# EAGLE design vhdci-fx2-gnd (EAGLE 6.4)
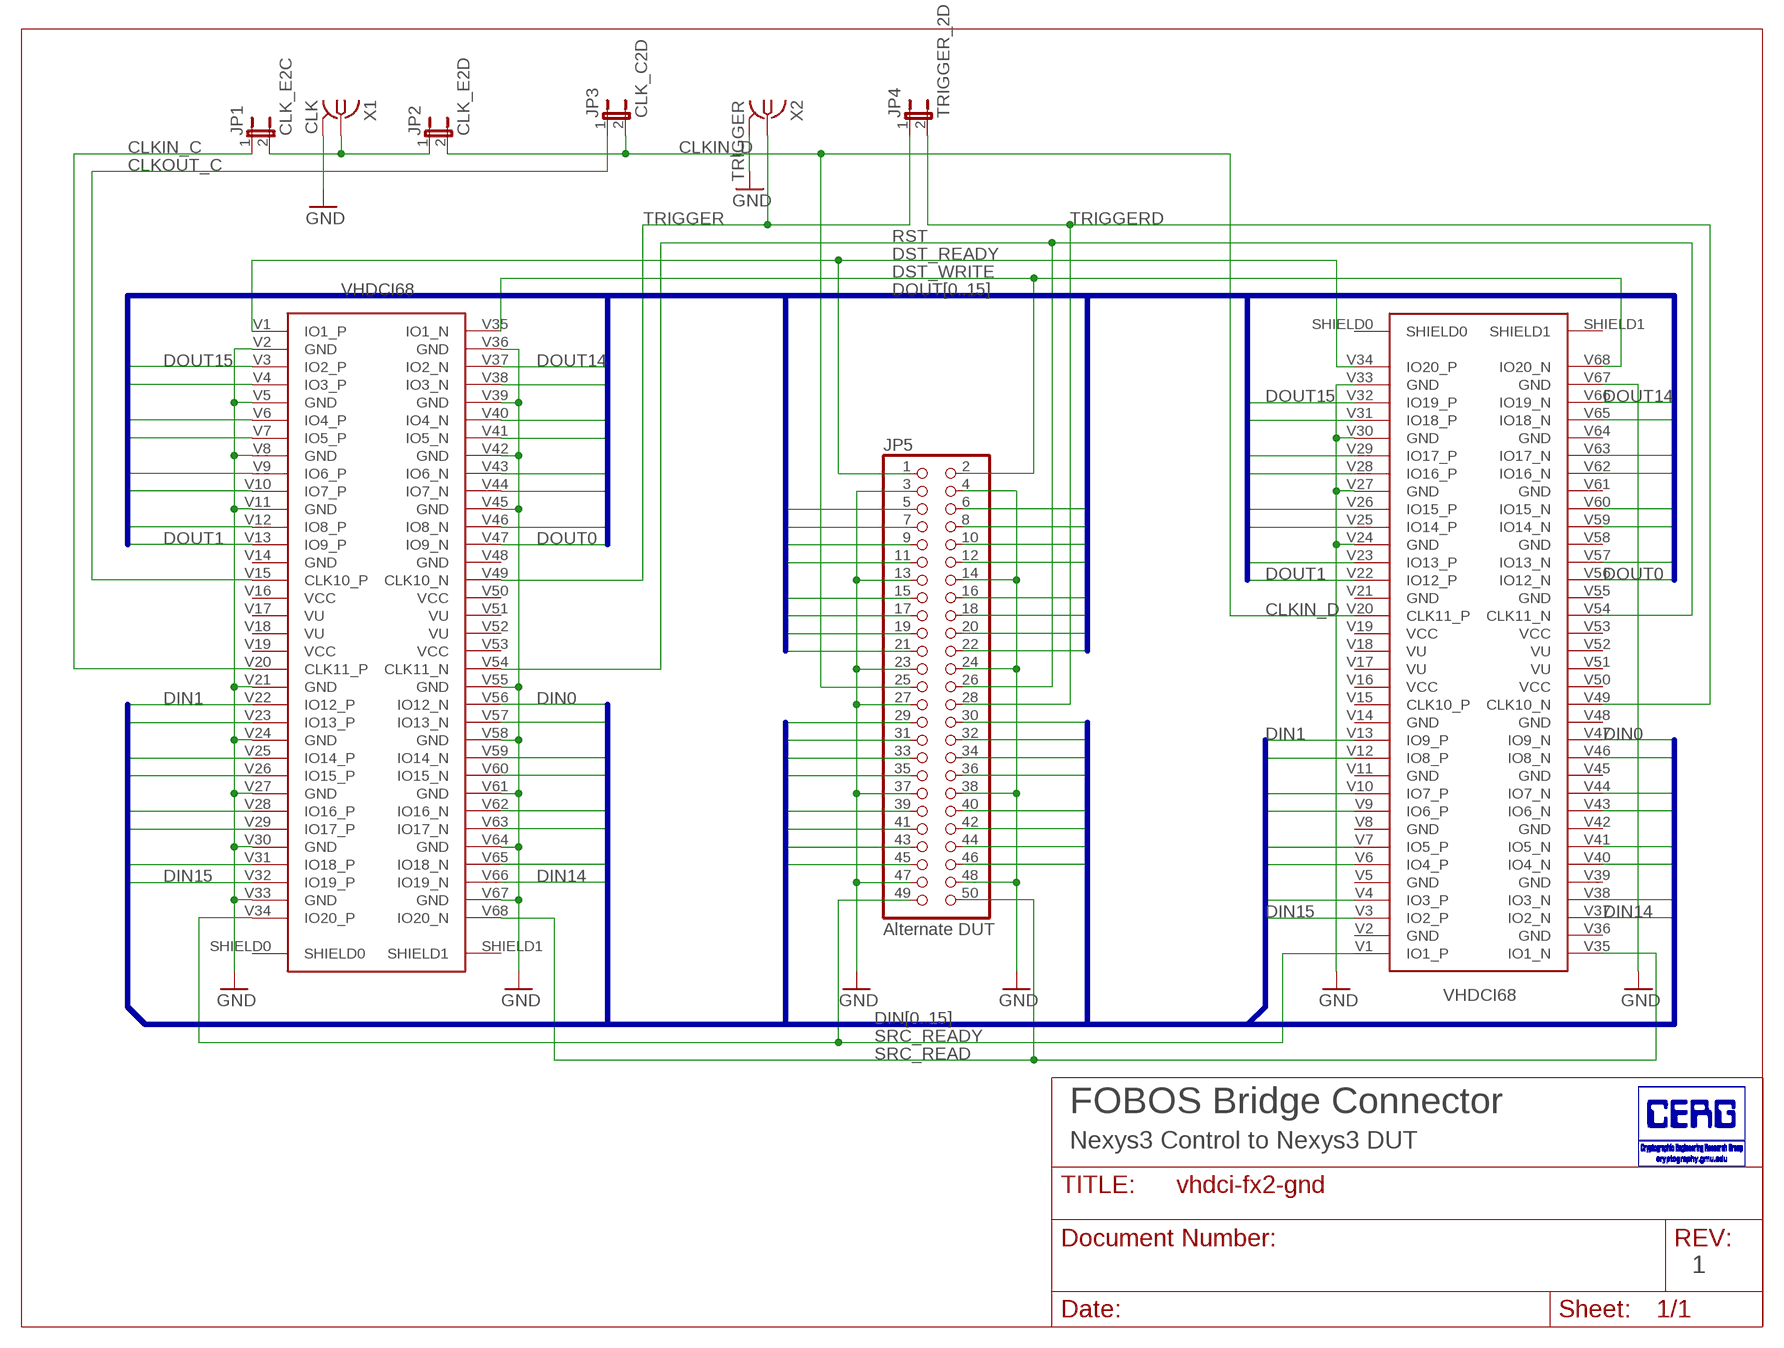
[diagram p0: schematic, sheet 1]

## Parts
JP1  CLK_E2C  JP1E  [JP1]
JP2  CLK_E2D  JP1E  [JP1]
JP3  CLK_C2D  JP1E  [JP1]
JP4  TRIGGER_2D  JP1E  [JP1]
JP5  Alternate DUT  PINHD-2X25  [2X25]
U$1  VHDCI68  [VHDCI68]
U$2  VHDCI68  [VHDCI68]
X1  CLK  BU-SMA-V  [BU-SMA-V]
X2  TRIGGER  BU-SMA-V  [BU-SMA-V]

## Nets
CLKIN_C: JP1.1 U$2.V20(CLK11_P)
CLKIN_D: JP2.2 JP3.2 JP5.25 U$1.V20(CLK11_P)
CLKOUT_C: JP3.1 U$2.V15(CLK10_P)
DIN0: JP5.30 U$1.V47(IO9_N) U$2.V56(IO12_N)
DIN1: JP5.29 U$1.V13(IO9_P) U$2.V22(IO12_P)
DIN2: JP5.32 U$1.V46(IO8_N) U$2.V57(IO13_N)
DIN3: JP5.31 U$1.V12(IO8_P) U$2.V23(IO13_P)
DIN4: JP5.34 U$1.V44(IO7_N) U$2.V59(IO14_N)
DIN5: JP5.33 U$1.V10(IO7_P) U$2.V25(IO14_P)
DIN6: JP5.36 U$1.V43(IO6_N) U$2.V60(IO15_N)
DIN7: JP5.35 U$1.V9(IO6_P) U$2.V26(IO15_P)
DIN8: JP5.40 U$1.V41(IO5_N) U$2.V62(IO16_N)
DIN9: JP5.39 U$1.V7(IO5_P) U$2.V28(IO16_P)
DIN10: JP5.42 U$1.V40(IO4_N) U$2.V63(IO17_N)
DIN11: JP5.41 U$1.V6(IO4_P) U$2.V29(IO17_P)
DIN12: JP5.44 U$1.V38(IO3_N) U$2.V65(IO18_N)
DIN13: JP5.43 U$1.V4(IO3_P) U$2.V31(IO18_P)
DIN14: JP5.46 U$1.V37(IO2_N) U$2.V66(IO19_N)
DIN15: JP5.45 U$1.V3(IO2_P) U$2.V32(IO19_P)
DOUT0: JP5.22 U$1.V56(IO12_N) U$2.V47(IO9_N)
DOUT1: JP5.21 U$1.V22(IO12_P) U$2.V13(IO9_P)
DOUT2: JP5.20 U$1.V57(IO13_N) U$2.V46(IO8_N)
DOUT3: JP5.19 U$1.V23(IO13_P) U$2.V12(IO8_P)
DOUT4: JP5.18 U$1.V59(IO14_N) U$2.V44(IO7_N)
DOUT5: JP5.17 U$1.V25(IO14_P) U$2.V10(IO7_P)
DOUT6: JP5.16 U$1.V60(IO15_N) U$2.V43(IO6_N)
DOUT7: JP5.15 U$1.V26(IO15_P) U$2.V9(IO6_P)
DOUT8: JP5.12 U$1.V62(IO16_N) U$2.V41(IO5_N)
DOUT9: JP5.11 U$1.V28(IO16_P) U$2.V7(IO5_P)
DOUT10: JP5.10 U$1.V63(IO17_N) U$2.V40(IO4_N)
DOUT11: JP5.9 U$1.V29(IO17_P) U$2.V6(IO4_P)
DOUT12: JP5.8 U$1.V65(IO18_N) U$2.V38(IO3_N)
DOUT13: JP5.7 U$1.V31(IO18_P) U$2.V4(IO3_P)
DOUT14: JP5.6 U$1.V66(IO19_N) U$2.V37(IO2_N)
DOUT15: JP5.5 U$1.V32(IO19_P) U$2.V3(IO2_P)
DST_READY: JP5.1 U$1.V34(IO20_P) U$2.V1(IO1_P)
DST_WRITE: JP5.2 U$1.V68(IO20_N) U$2.V35(IO1_N)
GND: JP5.3 JP5.4 JP5.13 JP5.14 JP5.23 JP5.24 JP5.27 JP5.37 JP5.38 JP5.47 JP5.48 U$1.V24(GND) U$1.V27(GND) U$1.V30(GND) U$1.V33(GND) U$1.V67(GND) U$2.V2(GND) U$2.V5(GND) U$2.V8(GND) U$2.V11(GND) U$2.V21(GND) U$2.V24(GND) U$2.V27(GND) U$2.V30(GND) U$2.V33(GND) U$2.V36(GND) U$2.V39(GND) U$2.V42(GND) U$2.V45(GND) U$2.V55(GND) U$2.V58(GND) U$2.V61(GND) U$2.V64(GND) U$2.V67(GND) X1.2(GND) X2.2(GND)
N$3: JP1.2 JP2.1 X1.1
RST: JP5.26 U$1.V54(CLK11_N) U$2.V54(CLK11_N)
SRC_READ: JP5.50 U$1.V35(IO1_N) U$2.V68(IO20_N)
SRC_READY: JP5.49 U$1.V1(IO1_P) U$2.V34(IO20_P)
TRIGGER: JP4.1 U$2.V49(CLK10_N) X2.1
TRIGGERD: JP4.2 JP5.28 U$1.V49(CLK10_N)
Unconnected: U$1.SHIELD0 U$1.SHIELD1 U$1.V2(GND) U$1.V5(GND) U$1.V8(GND) U$1.V11(GND) U$1.V14(GND) U$1.V15(CLK10_P) U$1.V21(GND) U$1.V36(GND) U$1.V39(GND) U$1.V42(GND) U$1.V45(GND) U$1.V48(GND) U$1.V55(GND) U$1.V58(GND) U$1.V61(GND) U$1.V64(GND) U$2.SHIELD0 U$2.SHIELD1 U$2.V14(GND) U$2.V48(GND)

## Buses
DIN[0..15]
DOUT[0..15]

## Notes on the sheet
- FOBOS Bridge Connector
- Nexys3 Control to Nexys3 DUT
- 1

## Power pins joined to a net without a drawn wire
GND: X1.3(GND) X1.4(GND) X1.5(GND) X2.3(GND) X2.4(GND) X2.5(GND)
VCC: U$1.V16(VCC) U$1.V19(VCC) U$1.V50(VCC) U$1.V53(VCC) U$2.V16(VCC) U$2.V19(VCC) U$2.V50(VCC) U$2.V53(VCC)
VU: U$1.V17(VU) U$1.V18(VU) U$1.V51(VU) U$1.V52(VU) U$2.V17(VU) U$2.V18(VU) U$2.V51(VU) U$2.V52(VU)

## Library data of the parts
JP1-JP4 = jumper:JP1E: JUMPER
JP5 = pinhead:PINHD-2X25: PIN HEADER
U$1 U$2 = tw:VHDCI68: Nexys 3 VHDCI 68pin 0.8mm pitch
X1 X2 = con-coax:BU-SMA-V: FEMALE SMA CONNECTOR Radiall distributor RS 112-3794; OC_FARNELL: unknown; OC_NEWARK: unknown

## Board
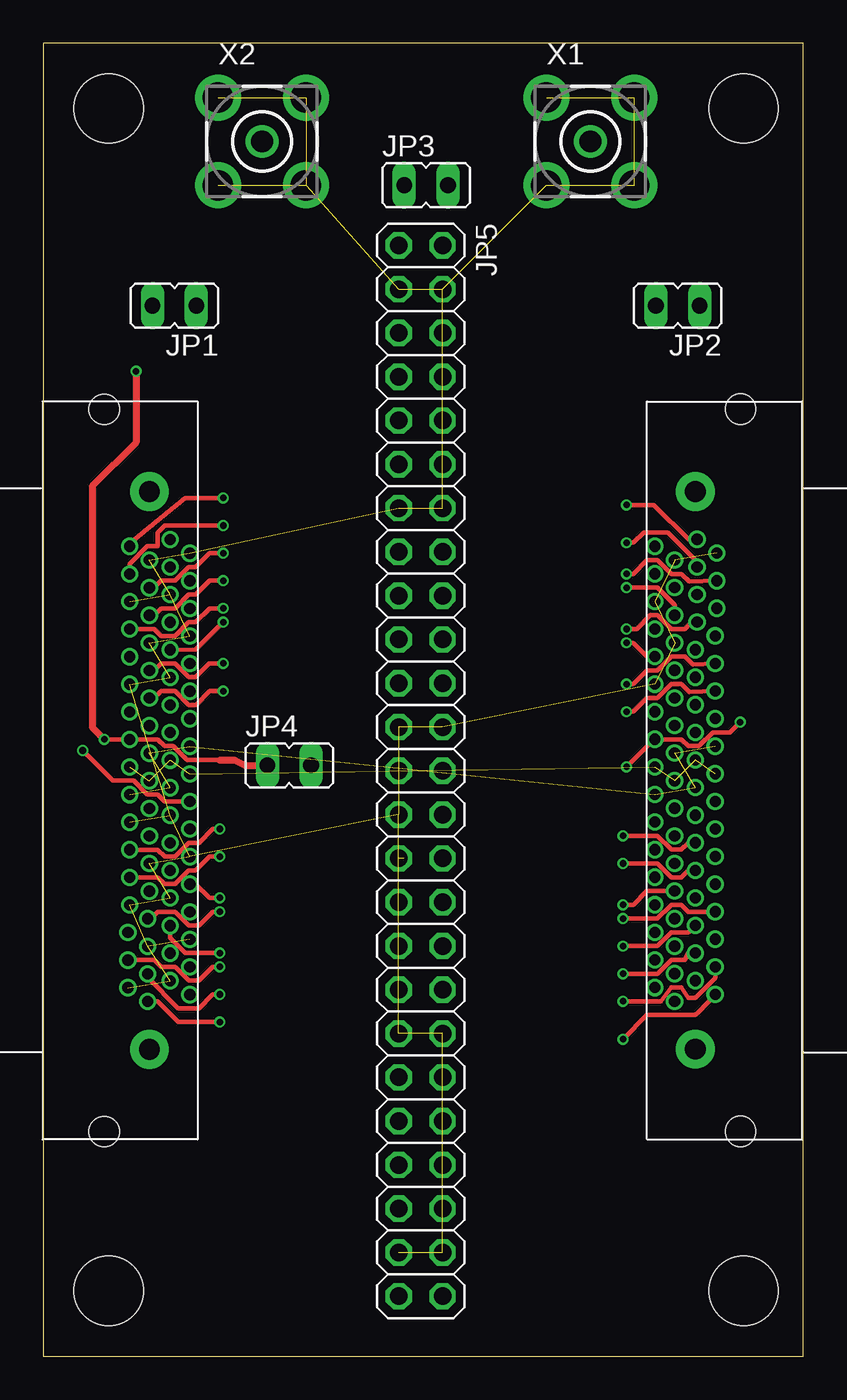
[diagram p1: board, top side]
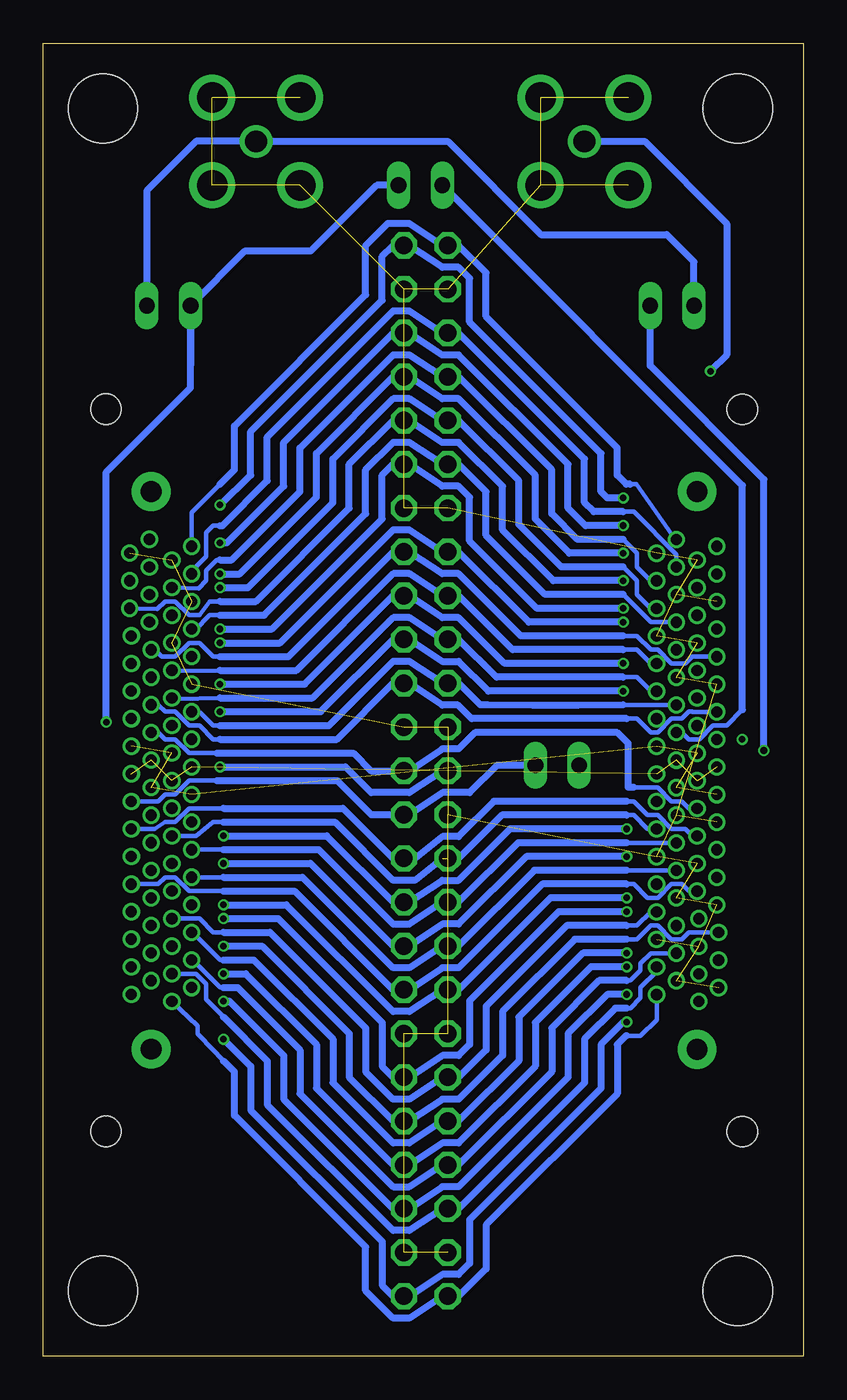
[diagram p2: board, bottom side, seen from below]

Size 44.12 x 76.19 mm. Coordinates in mm from the lower left corner, seen from the top.
Outline: 0,0 44.12,0 44.12,76.19 0,76.19 0,0
Copper layers (1*16): Top 0.035mm / dielectric 1.5mm / Bottom 0.035mm
Design rules "vhdci-fx2": minimum track width 5mil, minimum drill 15mil, track to track 5mil, track to pad 5mil, pad to pad 5mil, via to via 5mil, smd to smd 5mil, copper to edge 40mil, drill to drill 8mil, minimum pad ring 5mil, minimum via ring 5mil, stop-mask expansion 4mil, vias tented up to drill 0mil, thermal gap 10mil
Holes 4 mm at 3.81,72.39 3.81,3.81 40.64,3.81 40.64,72.39

### Footprints (pad centres in the part's own frame; a part is rotated, then mirrored left to right if it is on the bottom)
JP1 = drill 0.914 long: 1 0,-1.27; 2 0,1.27
2X25 = drill 1.016 octagon: 1 -30.48,-1.27; 2 -30.48,1.27; 3 -27.94,-1.27; 4 -27.94,1.27; 5 -25.4,-1.27; 6 -25.4,1.27; 7 -22.86,-1.27; 8 -22.86,1.27; 9 -20.32,-1.27; 10 -20.32,1.27; 11 -17.78,-1.27; 12 -17.78,1.27; 13 -15.24,-1.27; 14 -15.24,1.27; 15 -12.7,-1.27; 16 -12.7,1.27; 17 -10.16,-1.27; 18 -10.16,1.27; 19 -7.62,-1.27; 20 -7.62,1.27; 21 -5.08,-1.27; 22 -5.08,1.27; 23 -2.54,-1.27; 24 -2.54,1.27; 25 0,-1.27; 26 0,1.27; 27 2.54,-1.27; 28 2.54,1.27; 29 5.08,-1.27; 30 5.08,1.27; 31 7.62,-1.27; 32 7.62,1.27; 33 10.16,-1.27; 34 10.16,1.27; 35 12.7,-1.27; 36 12.7,1.27; 37 15.24,-1.27; 38 15.24,1.27; 39 17.78,-1.27; 40 17.78,1.27; 41 20.32,-1.27; 42 20.32,1.27; 43 22.86,-1.27; 44 22.86,1.27; 45 25.4,-1.27; 46 25.4,1.27; 47 27.94,-1.27; 48 27.94,1.27; 49 30.48,-1.27; 50 30.48,1.27
VHDCI68 = drill 1.2 pad 2.25: SHIELD0 18.375,-0.4; SHIELD1 -13.975,-0.4 | drill 0.65 pad 1: V1 -11.2,0.8; V2 -10.4,1.95; V3 -9.6,0.8; V4 -8.8,1.95; V5 -8,0.8; V6 -7.2,1.95; V7 -6.4,0.8; V8 -5.6,1.95; V9 -4.8,0.8; V10 -4,1.95; V11 -3.2,0.8; V12 -2.4,1.95; V13 -1.6,0.8; V14 -0.8,1.95; V15 0,0.8; V16 0.8,1.95; V17 1.6,0.8; V18 2.4,1.95; V19 3.2,0.8; V20 4,1.95; V21 4.8,0.8; V22 5.6,1.95; V23 6.4,0.8; V24 7.2,1.95; V25 8,0.8; V26 8.8,1.95; V27 9.6,0.8; V28 10.4,1.95; V29 11.2,0.8; V30 12,1.95; V31 12.8,0.8; V32 13.6,1.95; V33 14.4,0.8; V34 15.2,1.95; V35 -10.8,-1.55; V36 -10,-0.4; V37 -9.2,-1.55; V38 -8.4,-0.4; V39 -7.6,-1.55; V40 -6.8,-0.4; V41 -6,-1.55; V42 -5.2,-0.4; V43 -4.4,-1.55; V44 -3.6,-0.4; V45 -2.8,-1.55; V46 -2,-0.4; V47 -1.2,-1.55; V48 -0.4,-0.4; V49 0.4,-1.55; V50 1.2,-0.4; V51 2,-1.55; V52 2.8,-0.4; V53 3.6,-1.55; V54 4.4,-0.4; V55 5.2,-1.55; V56 6,-0.4; V57 6.8,-1.55; V58 7.6,-0.4; V59 8.4,-1.55; V60 9.2,-0.4; V61 10,-1.55; V62 10.8,-0.5; V63 11.6,-1.65; V64 12.4,-0.5; V65 13.2,-1.65; V66 14,-0.5; V67 14.8,-1.65; V68 15.6,-0.5 | hole 1.75: -18.75,-3.025; 23.15,-3.025
BU-SMA-V = drill 1.27: 1 0,0 | drill 1.778: 2 -2.55,2.55; 3 2.55,2.55; 4 2.55,-2.55; 5 -2.55,-2.55

### Placement (x,y rotation side)
JP1  7.62,60.96 90 top
JP2  36.83,60.96 90 top
JP3  22.23,67.94 270 top
JP4  14.29,34.29 270 top
JP5  21.91,33.97 270 top
U$1  37.45,31.8 90 top
U$2  6.57,36.19 270 top
X1  31.75,70.48 0 top
X2  12.7,70.48 0 top

### Tracks (layer width: path | path; a pad name or v marks a point on that pad's centre or on a via)
CLKIN_C  (via drill 0.38)
  Top 0.254: U$2.V20 7.06,32.19 6.65,32.6 6.05,32.6 5.25,33.4 4.05,33.4 v2.3,35.15
  Bottom 0.406: v2.3,35.15 2.3,50.88 8.89,57.47 JP1.1
CLKIN_D  (via drill 0.38)
  Top 0.254: v40.45,36.8 39.85,36.2 38.85,36.2 38.05,35.4 37.45,35.4 37.05,35.8 U$1.V20 35.45,35.8 v33.85,34.2
  Bottom 0.406: JP3.2 24.77,67.94 28.57,64.14 32.38,64.14 JP2.2 | JP2.2 35.56,57.47 | JP5.25 20.95,33.97 22.86,32.7 25.08,32.7 26.58,34.2 v33.85,34.2 | v40.45,36.8 40.45,51.31 35.56,56.2 JP2.2
CLKOUT_C
  Bottom 0.254: U$2.V15 7.04,36.19 6.65,35.8 6.05,35.8 5.25,36.6 4.45,36.6 3.53,37.52
  Bottom 0.406: 3.53,37.52 3.53,50.52 JP3.1
DIN0
  Bottom 0.254: U$2.V56 6.44,30.19 6.85,30.6 7.65,30.6 8.45,31.4 9.05,31.4 9.85,32.2 10.25,32.2 | U$1.V47 37.65,30.6 37.05,31 36.45,31 35.65,31.8 33.65,31.8
  Bottom 0.406: 10.25,32.2 17.97,32.2 20,30.16 20.95,30.16 22.54,28.89 JP5.30 23.81,28.89 26.72,31.8 33.65,31.8
DIN1  (1 unrouted)
  Bottom 0.254: U$2.V22 9.04,30.59 9.85,31.4 10.25,31.4 | U$1.V13 35.25,30.2 34.25,31 33.65,31
  Bottom 0.406: 10.25,31.4 17.49,31.4 20,28.89 20.95,28.89 22.54,27.62 23.81,27.62 27.19,31 33.65,31
DIN2  (via drill 0.38)
  Top 0.254: U$2.V57 6.66,29.39 7.05,29 7.65,29 8.45,29.8 9.05,29.8 9.85,30.6 v10.25,30.6 | U$1.V46 37.45,29.8 37.05,29.4 36.45,29.4 35.65,30.2 v33.65,30.2
  Bottom 0.406: v33.65,30.2 27.66,30.2 23.81,26.35 JP5.32 22.86,26.35 20.95,27.62 20,27.62 17.02,30.6 v10.25,30.6
DIN3
  Bottom 0.254: U$2.V23 10.24,29.79 10.25,29.8 | U$1.V12 33.65,29.4
  Bottom 0.406: 33.65,29.4 28.13,29.4 23.81,25.08 22.86,25.08 20.95,26.35 JP5.31 20,26.35 16.55,29.8 10.25,29.8
DIN4  (via drill 0.38)
  Top 0.254: U$2.V59 6.66,27.79 7.05,27.4 7.65,27.4 8.45,28.2 8.85,28.2 9.65,29 v10.25,29 | U$1.V44 37.45,28.2 37.05,27.8 36.45,27.8 35.65,28.6 v33.65,28.6
  Bottom 0.406: v10.25,29 16.09,29 20,25.08 20.95,25.08 22.86,23.81 JP5.34 23.81,23.81 28.6,28.6 v33.65,28.6
DIN5
  Bottom 0.254: U$2.V25 10.24,28.19 10.25,28.2 | U$1.V10 33.65,27.8
  Bottom 0.406: 10.25,28.2 15.62,28.2 20,23.81 JP5.33 20.95,23.81 22.86,22.54 23.81,22.54 29.07,27.8 33.65,27.8
DIN6
  Bottom 0.254: U$2.V60 6.64,26.99 7.05,27.4 7.65,27.4 8.45,26.6 9.05,26.6 9.85,27.4 10.25,27.4 | U$1.V43 37.45,27.4 37.05,27.8 36.45,27.8 35.65,27 33.65,27
  Bottom 0.406: 10.25,27.4 15.15,27.4 20,22.54 20.95,22.54 22.86,21.27 JP5.36 23.81,21.27 29.54,27 33.65,27
DIN7  (via drill 0.38)
  Top 0.254: U$2.V26 8.86,27.39 9.65,26.6 v10.25,26.6 | U$1.V9 35.05,27 34.25,26.2 v33.65,26.2
  Bottom 0.406: v10.25,26.6 14.67,26.6 20,21.27 JP5.35 20.95,21.27 22.86,20 23.81,20 30.01,26.2 v33.65,26.2
DIN8  (via drill 0.38)
  Top 0.254: U$2.V62 6.24,25.39 6.65,25.8 7.65,25.8 8.45,25 9.05,25 9.85,25.8 v10.25,25.8 | U$1.V41 37.45,25.8 37.05,26.2 36.45,26.2 35.65,25.4 v33.65,25.4
  Bottom 0.406: v10.25,25.8 14.21,25.8 19.37,20.64 19.37,18.1 20,17.46 20.95,17.46 22.86,16.19 JP5.40 23.81,16.19 24.45,16.83 24.45,19.37 30.48,25.4 v33.65,25.4
DIN9
  Bottom 0.254: U$2.V28 8.86,25.79 9.65,25 10.25,25 | U$1.V7 35.05,25.4 34.25,24.6 33.65,24.6
  Bottom 0.406: 10.25,25 13.74,25 18.41,20.32 18.41,17.78 20,16.19 JP5.39 20.95,16.19 22.86,14.92 23.81,14.92 25.4,16.51 25.4,19.05 30.95,24.6 33.65,24.6
DIN10  (via drill 0.38)
  Top 0.254: U$1.V40 37.45,24.6 36.45,24.6 35.65,23.8 v33.65,23.8
  Bottom 0.254: U$2.V63 6.64,24.59 6.65,24.6 7.05,24.2 7.65,24.2 8.45,25 8.85,25 9.65,24.2 10.25,24.2
  Bottom 0.406: 10.25,24.2 13.26,24.2 17.46,20 17.46,17.46 20,14.92 20.95,14.92 22.86,13.65 JP5.42 23.81,13.65 26.35,16.19 26.35,18.73 31.42,23.8 v33.65,23.8
DIN11  (via drill 0.38)
  Top 0.254: U$2.V29 7.37,24.28 8.25,23.4 v10.25,23.4
  Bottom 0.254: U$1.V6 35.45,24.6 33.85,23 33.65,23
  Bottom 0.406: v10.25,23.4 12.79,23.4 16.51,19.68 16.51,17.14 20,13.65 JP5.41 20.95,13.65 22.86,12.38 23.81,12.38 27.3,15.88 27.3,18.41 31.89,23 33.65,23
DIN12  (via drill 0.38)
  Top 0.254: U$2.V65 6.44,22.99 6.45,23 6.85,22.6 7.65,22.6 8.45,21.8 9.05,21.8 9.85,22.6 v10.25,22.6 | U$1.V38 37.45,23.4 37.25,23 36.45,23 35.65,22.2 v33.65,22.2
  Bottom 0.406: v10.25,22.6 12.33,22.6 15.56,19.37 15.56,16.83 20,12.38 20.95,12.38 22.86,11.11 JP5.44 23.81,11.11 28.26,15.56 28.26,18.1 32.36,22.2 v33.65,22.2
DIN13
  Bottom 0.254: U$2.V31 8.86,23.39 9.45,22.8 9.45,22.4 10.05,21.8 10.25,21.8 | U$1.V4 35.45,23 33.85,21.4 33.65,21.4
  Bottom 0.406: 10.25,21.8 11.85,21.8 14.6,19.05 14.6,16.51 20,11.11 JP5.43 20.95,11.11 22.86,9.84 23.81,9.84 29.21,15.24 29.21,17.78 32.83,21.4 33.65,21.4
DIN14  (via drill 0.38)
  Top 0.254: U$2.V66 6.07,21.98 7.85,20.2 9.05,20.2 9.85,21 v10.25,21 | v33.65,20.6 35.85,20.6 36.45,21.4 37.05,21.4 37.45,20.8 37.85,20.8 39,21.95 U$1.V37
  Bottom 0.406: v10.25,21 11.38,21 13.65,18.73 13.65,16.19 20,9.84 20.95,9.84 22.86,8.57 JP5.46 23.81,8.57 30.16,14.92 30.16,17.46 33.3,20.6 v33.65,20.6
DIN15
  Bottom 0.254: U$2.V32 8.52,22.33 9.45,21.4 9.45,20.8 10.05,20.2 10.25,20.2 | U$1.V3 35.25,22.2 34.65,21.6 34.65,20.72 33.97,20 33.66,19.68
  Bottom 0.406: 10.25,20.2 10.92,20.2 12.7,18.41 12.7,15.88 20,8.57 JP5.45 20.95,8.57 22.86,7.3 23.81,7.3 31.12,14.61 31.12,17.14 33.66,19.68
DOUT0
  Bottom 0.254: U$2.V47 6.44,37.39 6.45,37.4 6.65,37.4 7.05,37 7.65,37 8.45,36.2 8.85,36.2 9.65,37 10.25,37 | U$1.V56 37.4,37.75 37.05,37.4 36.45,37.4 35.65,36.6 35.05,36.6 34.25,35.8 33.85,35.8
  Bottom 0.406: 10.25,37 19.25,37 20.03,37.78 20.95,37.78 22.86,39.05 JP5.22 23.81,39.05 27.06,35.8 33.85,35.8
DOUT1
  Bottom 0.254: U$1.V22 35,37.35 34.25,36.6 33.85,36.6 | U$2.V13 10.44,37.79 10.45,37.8
  Bottom 0.406: 10.45,37.8 arc2 18.33,37.8 18.75,37.8 20,39.05 JP5.21 20.95,39.05 22.86,40.32 23.81,40.32 27.53,36.6 33.85,36.6
DOUT2  (via drill 0.38)
  Top 0.254: U$2.V46 6.44,38.19 6.85,38.6 7.65,38.6 8.45,37.8 8.89,37.78 9.65,38.6 v10.45,38.6 | U$1.V57 37.5,38.55 37.05,39 36.45,39 35.65,38.2 35.05,38.2 34.25,37.4 v33.85,37.4
  Bottom 0.406: v10.45,38.6 18.28,38.6 20,40.32 20.95,40.32 22.86,41.59 JP5.20 23.81,41.59 28,37.4 v33.85,37.4
DOUT3
  Bottom 0.254: U$2.V12 8.85,38.6 9.65,39.4 10.45,39.4 | U$1.V23 36.3,38.15 33.85,38.2
  Bottom 0.406: 10.45,39.4 17.81,39.4 20,41.59 JP5.19 20.95,41.59 22.86,42.86 23.81,42.86 28.48,38.2 33.85,38.2
DOUT4  (via drill 0.38)
  Top 0.254: U$2.V44 6.44,39.79 6.85,40.2 7.65,40.2 8.45,39.4 8.85,39.4 9.64,40.2 10.42,40.2 v10.45,40.2 | U$1.V59 37.7,40.15 37.25,40.6 36.45,40.6 35.65,39.8 35.05,39.8 34.25,39 v33.85,39
  Bottom 0.406: v10.45,40.2 17.34,40.2 20,42.86 20.95,42.86 22.86,44.13 JP5.18 23.81,44.13 28.95,39 v33.85,39
DOUT5
  Bottom 0.254: U$2.V10 8.85,40.2 9.65,41 10.45,41 | U$1.V25 36.3,39.75 33.85,39.8
  Bottom 0.406: 10.45,41 16.87,41 20,44.13 JP5.17 20.95,44.13 22.86,45.4 23.81,45.4 29.41,39.8 33.85,39.8
DOUT6
  Bottom 0.254: U$2.V43 6.46,40.59 6.85,40.2 7.65,40.2 8.45,41 8.85,41 9.65,41.8 10.45,41.8 | U$1.V60 37.6,40.95 37.25,40.6 36.45,40.6 35.65,41.4 35.05,41.4 34.25,40.6 33.85,40.6
  Bottom 0.406: 10.45,41.8 16.4,41.8 20,45.4 20.95,45.4 22.86,46.67 JP5.16 23.81,46.67 29.88,40.6 33.85,40.6
DOUT7  (via drill 0.38)
  Top 0.254: U$2.V9 8.85,41 v10.45,42.6 | U$1.V26 35.1,40.55 34.25,41.4 v33.85,41.4
  Bottom 0.406: v10.45,42.6 15.93,42.6 20,46.67 JP5.15 20.95,46.67 22.86,47.94 23.81,47.94 30.35,41.4 v33.85,41.4
DOUT8  (via drill 0.38)
  Top 0.254: U$2.V41 6.46,42.19 6.85,41.8 7.65,41.8 8.45,42.6 8.85,42.6 9.65,43.4 v10.45,43.4 | U$1.V62 37.6,42.55 37.25,42.2 36.45,42.2 35.65,43 35.25,43 34.45,42.2 v33.85,42.2
  Bottom 0.406: v10.45,43.4 15.46,43.4 19.37,47.31 19.37,49.85 20,50.48 20.95,50.48 22.86,51.75 JP5.12 23.81,51.75 24.45,51.12 24.45,48.58 30.82,42.2 v33.85,42.2
DOUT9
  Bottom 0.254: U$2.V7 8.84,42.59 10.45,44.2 | U$1.V28 35.3,42.15 34.45,43 33.85,43
  Bottom 0.406: 10.45,44.2 14.99,44.2 18.41,47.62 18.41,50.16 20,51.75 JP5.11 20.95,51.75 22.86,53.02 23.81,53.02 25.4,51.44 25.4,48.9 31.3,43 33.85,43
DOUT10  (via drill 0.38)
  Top 0.254: U$2.V40 6.44,42.99 6.85,43.4 7.65,43.4 8.45,44.2 8.85,44.2 9.65,45 v10.45,45
  Bottom 0.254: U$1.V63 37.5,43.35 37.05,43.8 36.45,43.8 35.65,43 35.05,43 34.45,43.8 33.85,43.8
  Bottom 0.406: v10.45,45 14.52,45 17.46,47.94 17.46,50.48 20,53.02 20.95,53.02 22.86,54.29 JP5.10 23.81,54.29 26.35,51.75 26.35,49.21 31.77,43.8 33.85,43.8
DOUT11  (via drill 0.38)
  Top 0.254: U$1.V29 36.66,43.59 35.65,44.6 v33.85,44.6
  Bottom 0.254: U$2.V6 8.84,43.39 9.65,44.2 9.65,45 10.45,45.8
  Bottom 0.406: 10.45,45.8 14.05,45.8 16.51,48.26 16.51,50.8 20,54.29 JP5.9 20.95,54.29 22.86,55.56 23.81,55.56 27.3,52.07 27.3,49.53 32.23,44.6 v33.85,44.6
DOUT12  (via drill 0.38)
  Top 0.254: U$2.V38 6.44,44.59 6.85,45 7.65,45 8.45,45.8 8.85,45.8 9.65,46.6 v10.45,46.6 | U$1.V65 37.5,44.95 37.05,45.4 36.45,45.4 35.65,46.2 35.05,46.2 34.25,45.4 v33.85,45.4
  Bottom 0.406: v10.45,46.6 13.58,46.6 15.56,48.58 15.56,51.12 20,55.56 20.95,55.56 22.86,56.83 JP5.8 23.81,56.83 28.26,52.39 28.26,49.85 32.7,45.4 v33.85,45.4
DOUT13
  Bottom 0.254: U$2.V4 8.84,44.99 9.65,45.8 9.65,46.6 10.45,47.4 | U$1.V31 35.1,44.55 34.65,45 34.65,45.6 34.05,46.2 33.85,46.2
  Bottom 0.406: 10.45,47.4 13.11,47.4 14.6,48.9 14.6,51.44 20,56.83 JP5.7 20.95,56.83 22.86,58.1 23.81,58.1 29.21,52.7 29.21,50.16 33.17,46.2 33.85,46.2
DOUT14  (via drill 0.38)
  Top 0.254: U$2.V37 5.02,45.97 6.05,47 6.65,47 6.65,47.8 7.05,48.2 v10.45,48.2 | U$1.V66 37.96,46.09 36.25,47.8 34.85,47.8 34.25,47.2 v33.85,47.2
  Bottom 0.406: v10.45,48.2 12.64,48.2 13.65,49.21 13.65,51.75 20,58.1 20.95,58.1 22.86,59.37 JP5.6 23.81,59.37 30.16,53.02 30.16,50.48 33.45,47.2 v33.85,47.2
DOUT15
  Bottom 0.254: U$1.V32 35.52,45.53 34.65,46.4 34.65,47.8 34.25,48.2 33.85,48.2 | U$2.V3 7.37,46.52 9.85,49 10.45,49
  Bottom 0.406: 10.45,49 12.17,49 12.7,49.53 12.7,52.07 20,59.37 JP5.5 20.95,59.37 22.86,60.64 23.81,60.64 31.12,53.34 31.12,50.8 33.71,48.2 33.85,48.2
DST_READY
  Bottom 0.254: U$2.V1 7.44,47.39 9.69,50.6 10.05,50.6 | 33.85,50.6 35.5,48.95 U$1.V34
  Bottom 0.406: 33.85,50.6 33.02,51.44 33.02,53.98 25.4,61.59 25.4,64.45 24.13,65.72 22.86,65.72 20.95,64.45 JP5.1 20,64.45 18.41,62.87 18.41,60.33 10.79,52.7 10.79,51.12 10.28,50.6 10.05,50.6
DST_WRITE  (via drill 0.38)
  Top 0.254: U$2.V35 5.02,47.17 6.05,48 8.25,49.8 v10.45,49.8 | U$1.V68 37.5,47.35 35.45,49.4 v33.85,49.4
  Bottom 0.406: v33.85,49.4 32.07,51.12 32.07,53.66 24.45,61.28 24.45,63.82 23.81,64.45 JP5.2 22.86,64.45 20.95,63.18 20,63.18 19.37,62.55 19.37,60.01 11.75,52.39 11.75,50.16 11.38,49.8 v10.45,49.8
GND  (41 unrouted)
N$3
  Bottom 0.406: JP1.2 6.35,63.5 7.94,65.09 15.24,65.09 20.64,70.48 X1.1 35.24,70.48 38.1,67.63 JP2.1
RST
  Bottom 0.254: U$2.V54 6.64,31.79 7.05,32.2 7.65,32.2 8.45,33 9.05,33 9.84,33.02 | U$1.V54 37.45,36.2 37.05,35.8 36.45,35.8 35.65,35 34.05,35
  Bottom 0.406: 34.05,35 26.11,35 25.08,33.97 JP5.26 22.86,33.97 20.95,35.24 20,35.24 19.05,36.2 10.79,36.2 10.16,35.56 10.16,33.02 9.84,33.02
SRC_READ  (via drill 0.38)
  Top 0.254: U$2.V68 6.66,20.59 7.85,19.4 v10.25,19.4 | U$1.V35 38.05,20 37.85,19.8 35.05,19.8 v33.65,18.4
  Bottom 0.406: v10.25,19.4 10.45,19.4 11.75,18.1 11.75,15.56 19.37,7.94 19.37,5.4 20,4.76 20.95,4.76 22.86,3.49 JP5.50 23.81,3.49 24.45,4.13 24.45,6.67 32.07,14.29 32.07,16.83 v33.65,18.4
SRC_READY
  Bottom 0.254: U$2.V34 8.52,19.53 9.45,18.6 10.25,18.6 | U$1.V1 35.16,19.17 35.16,18.71 35.05,18.6 33.66,17.14
  Bottom 0.406: 10.25,18.6 10.29,18.6 10.79,18.1 10.79,15.24 18.41,7.62 18.41,5.08 20,3.49 JP5.49 20.95,3.49 22.86,2.22 23.81,2.22 25.4,3.81 25.4,6.35 33.02,13.97 33.02,16.51 33.66,17.14
TRIGGER  (via drill 0.38)
  Top 0.254: 10.25,34.6 8.35,34.6 7.55,35.4 7.05,35.4 6.66,35.79 U$2.V49 v3.56,35.79
  Top 0.406: 10.25,34.6 11.12,34.6 11.75,34.29 JP4.1 | v5.4,57.15 5.4,53.02 2.86,50.48 2.86,36.49 v3.55,35.8
  Bottom 0.254: v3.56,35.79 v3.55,35.8
  Bottom 0.406: X2.1 9.21,70.48 4.45,65.72 4.45,58.1 v5.4,57.15
TRIGGERD
  Bottom 0.254: U$1.V49 37.45,32.2 37.05,32.6 36.45,32.6 35.65,33.4 34.05,33.4
  Bottom 0.406: 34.05,33.4 27.05,33.4 25.08,31.43 JP5.28 22.86,31.43 20.95,32.7 19.37,32.7 17.78,34.29 JP4.2
VCC  (7 unrouted)
VU  (7 unrouted)